# Altium project GargantuRAM_1_5_PRE_GITHUB.PrjPcb (part 3 of 3)

## Sheet Clock.SchDoc
size A0; SheetNumber: 10; SheetTotal: 12
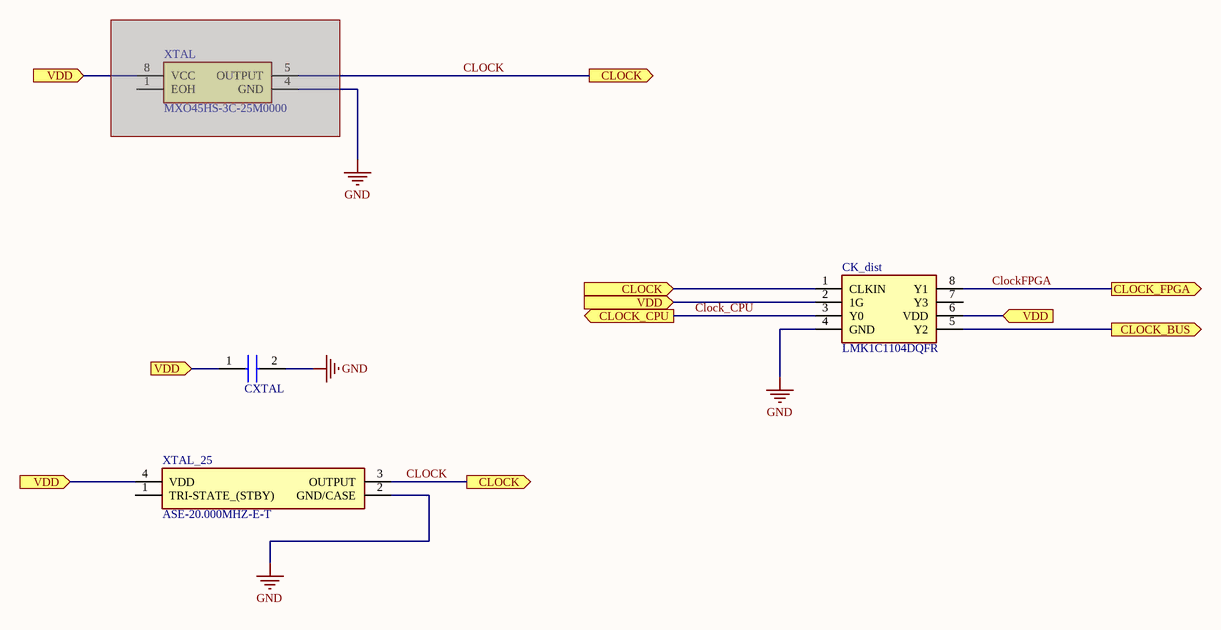
[diagram p18: Clock.SchDoc]

### Parts
CK_dist  LMK1C1104DQFR  [SON50P200X200X80-8N]
CXTAL  GRM155R71C104JA88D  [CAPC1005X55N]  (value not drawn)
XTAL  MXO45HS-3C-25M0000  [MXO45HS3C25M0000]  (masked out: inside a compile mask, not in the netlist)
XTAL_25  ASE-20.000MHZ-E-T  [ASE24576MHZLCT]

### Ports
CLOCK (in), CLOCK (out), CLOCK_BUS (out), CLOCK_CPU (out), CLOCK_FPGA (out), VDD (in)

### Nets
GND: CK_dist.4(GND) CXTAL.2 XTAL_25.2(GND/CASE)
CLOCK: CK_dist.1(CLKIN) XTAL_25.3(OUTPUT) ; port CLOCK
Clock_CPU: CK_dist.3(Y0) ; port CLOCK_CPU
ClockFPGA: CK_dist.8(Y1) ; port CLOCK_FPGA
VDD: CK_dist.2(1G) CK_dist.6(VDD) CXTAL.1 XTAL_25.4(VDD) ; port VDD
NetCK_dist_5: CK_dist.5(Y2) ; port CLOCK_BUS

Not connected (* = marked no-connect by the designer): CK_dist 7(Y3); XTAL_25 1(TRI-STATE_(STBY))

### Library data of the parts
CK_dist = LMK1C1104DQFR: Integrated Circuit; Manufacturer_Name: Texas Instruments; Datasheet Link: https://www.ti.com/lit/ds/symlink/lmk1c1104.pdf?ts=1625794058723&ref_url=https%253A%252F%252Fwww.ti.com%252Fproduct%252FLMK1C1104; Height: 0.8mm; Manufacturer_Part_Number: LMK1C1104DQFR; Mouser Part Number: 595-LMK1C1104DQFR; Mouser Price/Stock: https://www.mouser.co.uk/ProductDetail/Texas-Instruments/LMK1C1104DQFR?qs=QNEnbhJQKvYdwt0bSAj%252Blw%3D%3D; Arrow Part Number: LMK1C1104DQFR; Arrow Price/Stock: https://www.arrow.com/en/products/lmk1c1104dqfr/texas-instruments?utm_currency=USD&region=nac
CXTAL = GRM155R71C104JA88D: Capacitor; Manufacturer_Name: Murata Electronics; Datasheet Link: http://www.murata.com/~/media/webrenewal/support/library/catalog/products/capacitor/mlcc/c02e.pdf; Height: 0.55mm; Manufacturer_Part_Number: GRM155R71C104JA88D; Mouser Part Number: 81-GRM155R71C104JA8D; Mouser Price/Stock: https://www.mouser.co.uk/ProductDetail/Murata-Electronics/GRM155R71C104JA88D?qs=pwh76yelNxDjPOceoz6xEg%3D%3D; Arrow Part Number: GRM155R71C104JA88D; Arrow Price/Stock: https://www.arrow.com/en/products/grm155r71c104ja88d/murata-manufacturing?region=nac
XTAL = MXO45HS-3C-25M0000: Crystal or Oscillator; Manufacturer_Name: CTS; Datasheet Link: https://datasheet.datasheetarchive.com/originals/distributors/Datasheets-DGA23/1439510.pdf; Height: 5.1mm; Manufacturer_Part_Number: MXO45HS-3C-25M0000; Mouser Part Number: 774-MXO45HS-3C-25.0; Mouser Price/Stock: https://www.mouser.co.uk/ProductDetail/CTS-Electronic-Components/MXO45HS-3C-25M0000?qs=hbgUSdfWRJXvFrsG0%252BtHbQ%3D%3D; Arrow Part Number: MXO45HS-3C-25M0000; Arrow Price/Stock: https://www.arrow.com/en/products/mxo45hs-3c-25m0000/cts
XTAL_25 = ASE-20.000MHZ-E-T: Crystal or Oscillator; Manufacturer_Name: ABRACON; Datasheet Link: https://abracon.com/Oscillators/ASEseries.pdf; Height: 1.2mm; Manufacturer_Part_Number: ASE-20.000MHZ-E-T; Mouser Part Number: 815-ASE-20.0M-E-T; Mouser Price/Stock: https://www.mouser.co.uk/ProductDetail/ABRACON/ASE-20.000MHz-E-T?qs=s46Hw6dZPL6LHFubn7CneQ%3D%3D

## Sheet DataBUS.SchDoc
size A0; SheetNumber: 11; SheetTotal: 12
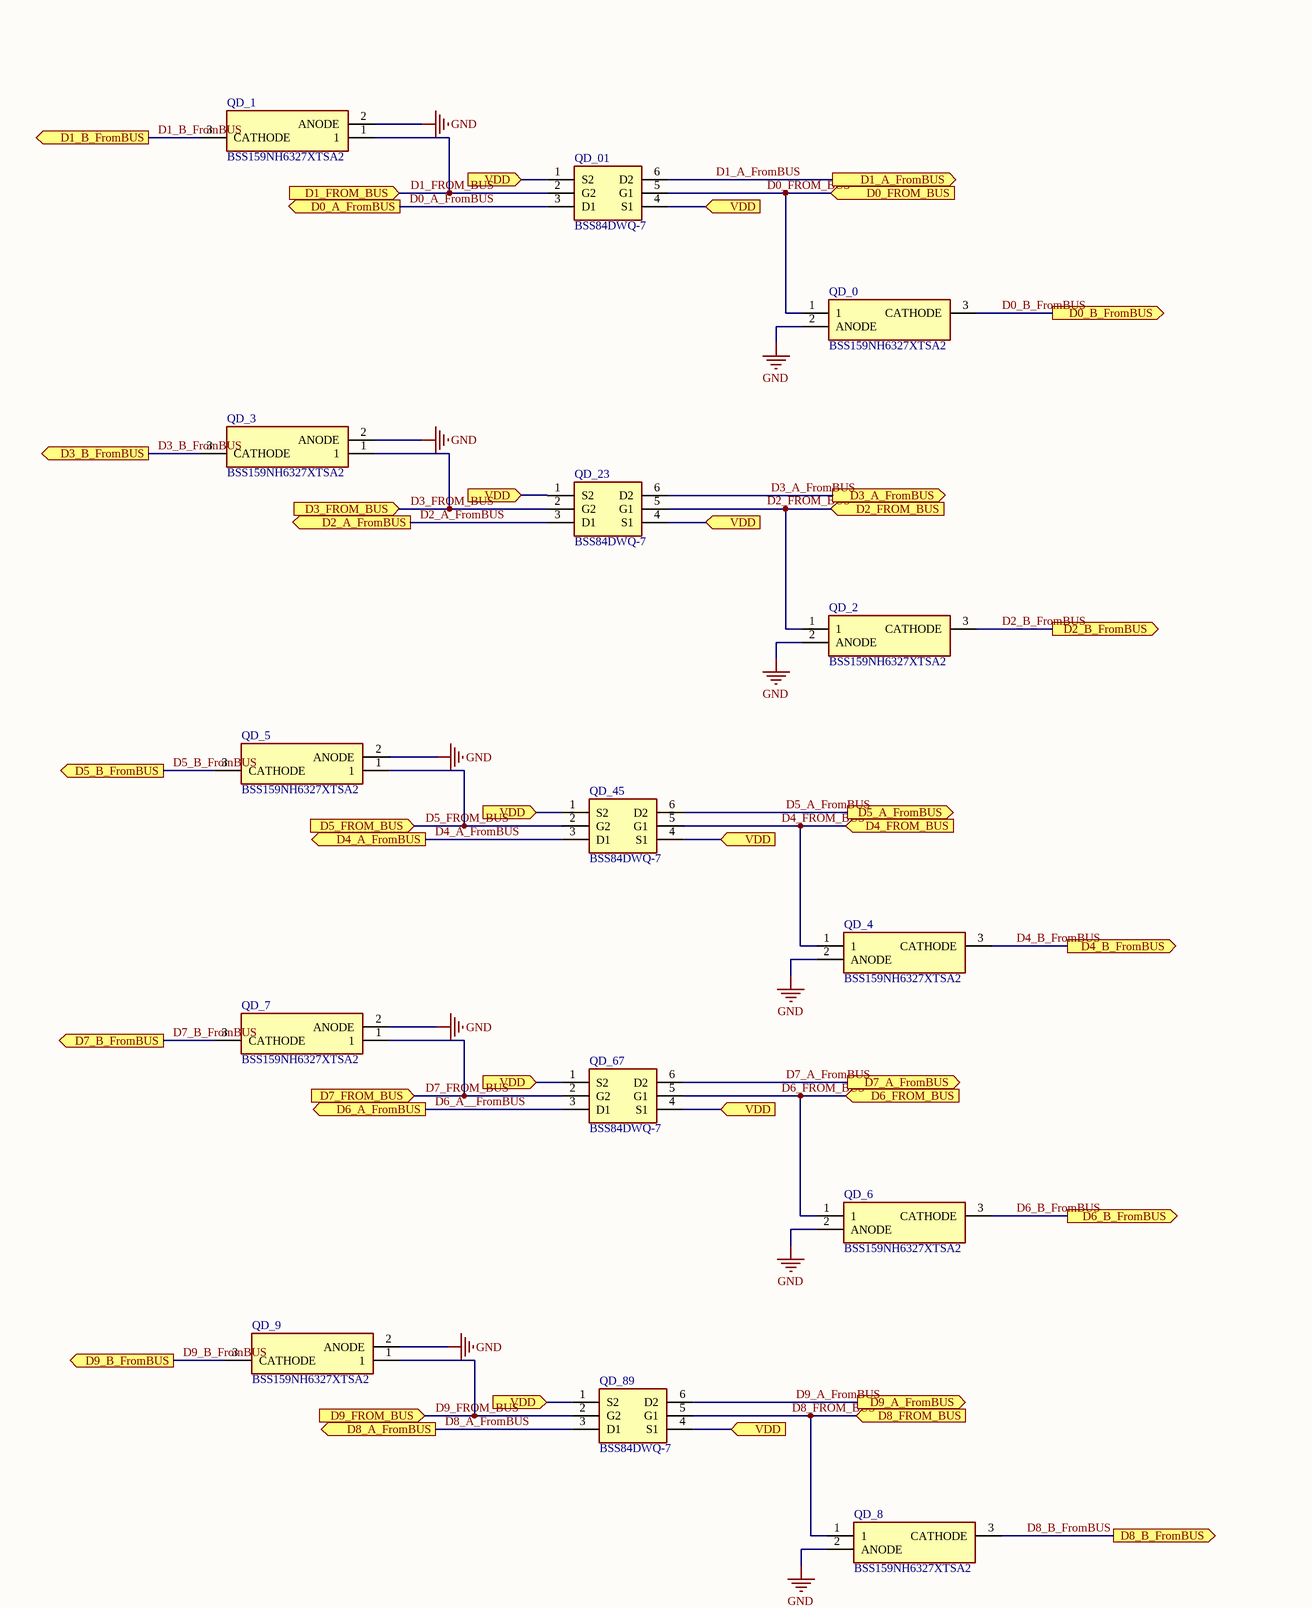
[diagram p19: DataBUS.SchDoc, top left]
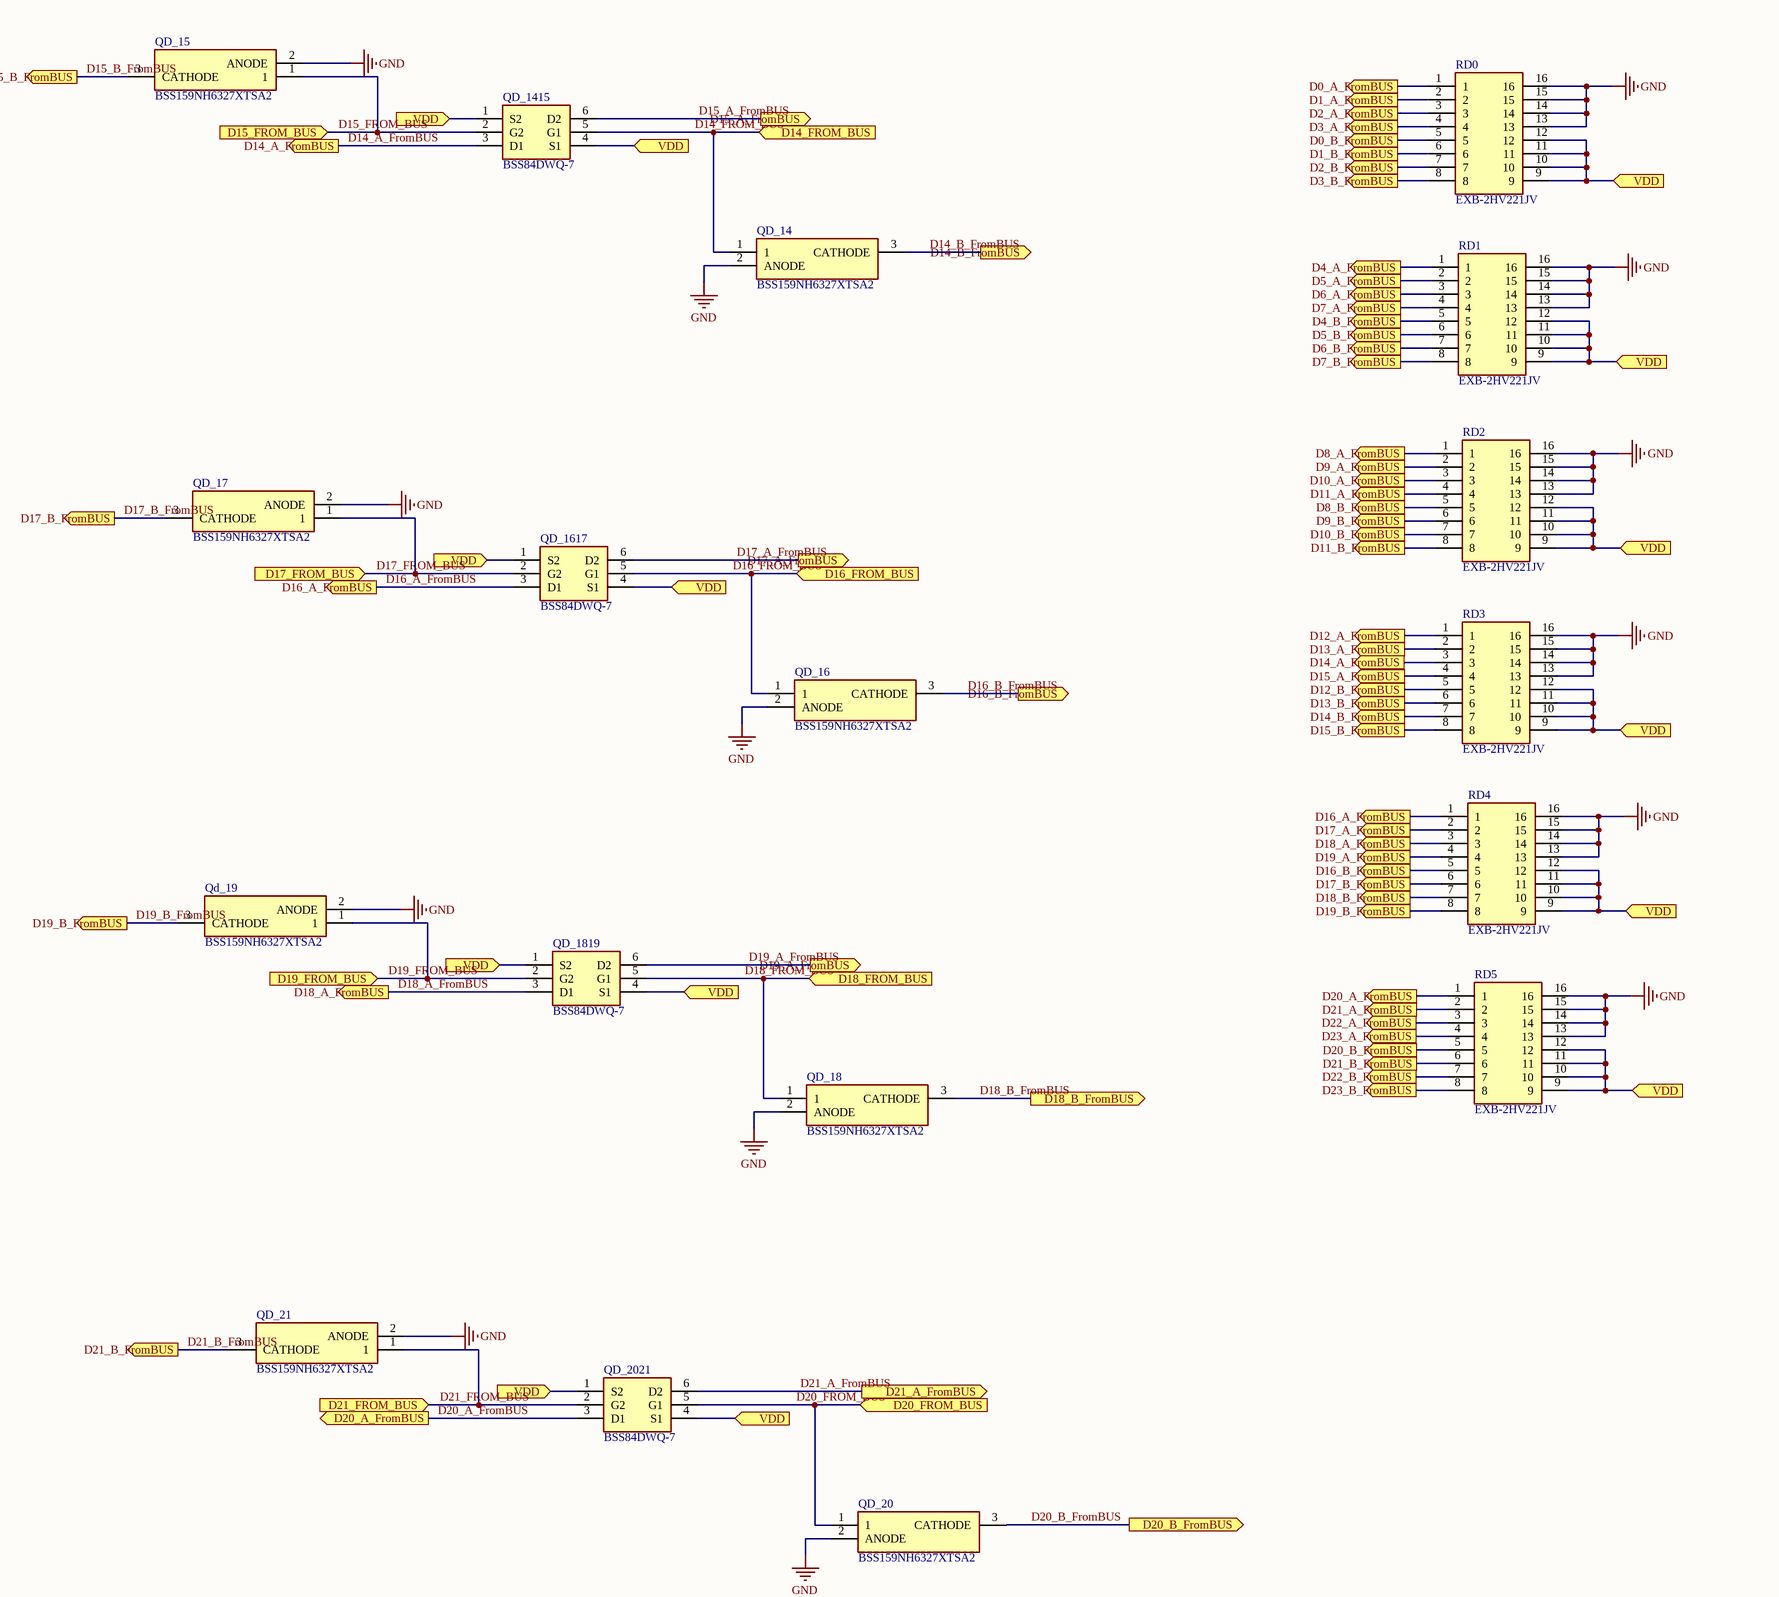
[diagram p20: DataBUS.SchDoc, top middle]
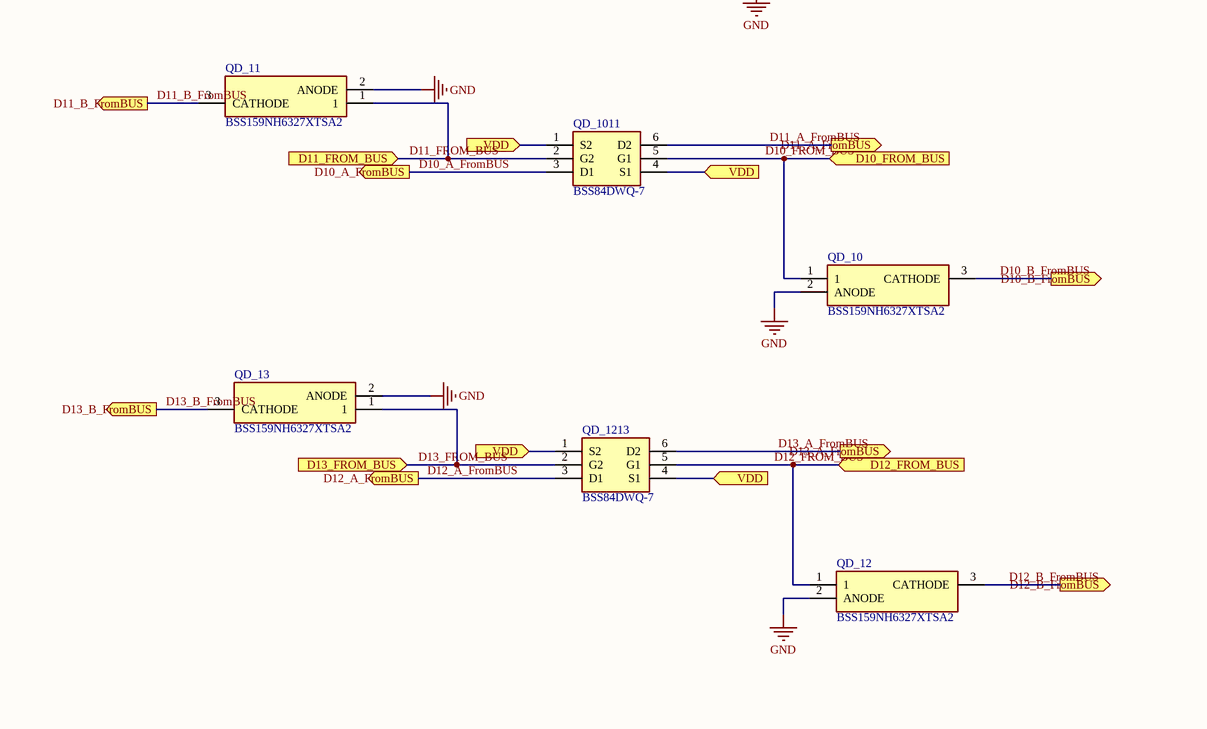
[diagram p21: DataBUS.SchDoc, bottom left]
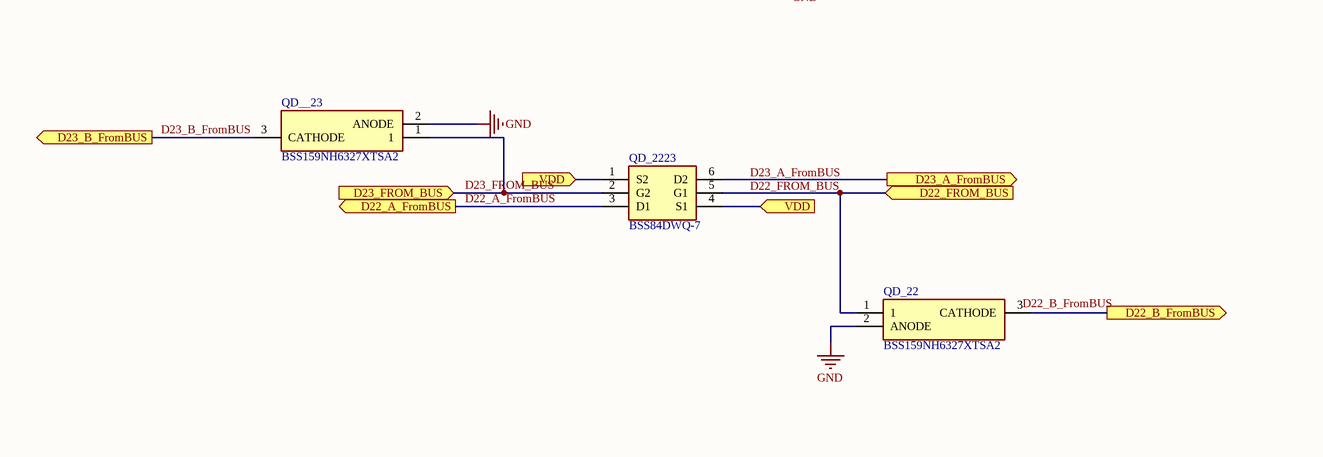
[diagram p22: DataBUS.SchDoc, bottom middle]
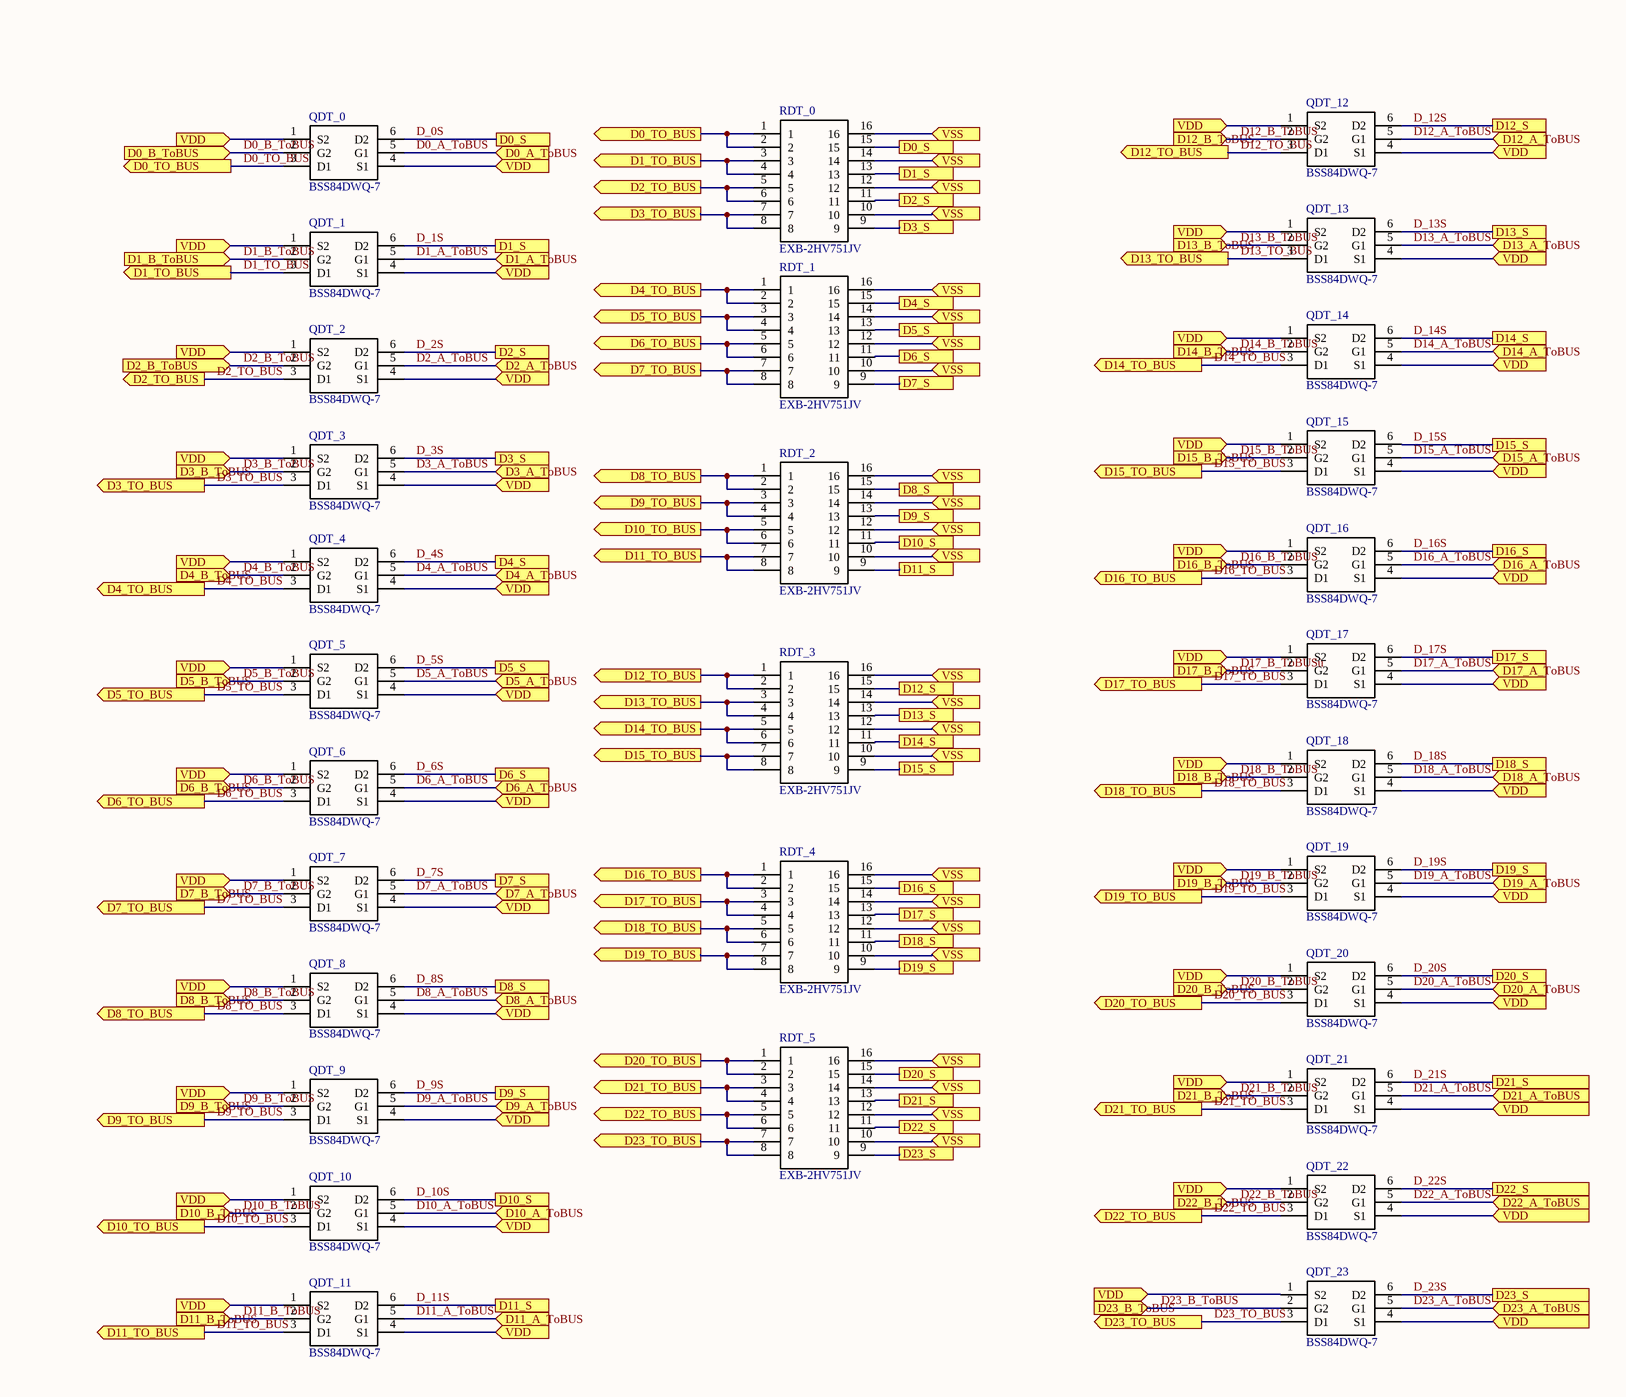
[diagram p23: DataBUS.SchDoc, bottom right]

### Parts
QD_0  BSS159NH6327XTSA2  [SOT95P260X110-3N]
QD_01  BSS84DWQ-7  [SOT65P210X110-6N]
QD_1  BSS159NH6327XTSA2  [SOT95P260X110-3N]
QD_2  BSS159NH6327XTSA2  [SOT95P260X110-3N]
QD_3  BSS159NH6327XTSA2  [SOT95P260X110-3N]
QD_4  BSS159NH6327XTSA2  [SOT95P260X110-3N]
QD_5  BSS159NH6327XTSA2  [SOT95P260X110-3N]
QD_6  BSS159NH6327XTSA2  [SOT95P260X110-3N]
QD_7  BSS159NH6327XTSA2  [SOT95P260X110-3N]
QD_8  BSS159NH6327XTSA2  [SOT95P260X110-3N]
QD_9  BSS159NH6327XTSA2  [SOT95P260X110-3N]
QD_10  BSS159NH6327XTSA2  [SOT95P260X110-3N]
QD_11  BSS159NH6327XTSA2  [SOT95P260X110-3N]
QD_12  BSS159NH6327XTSA2  [SOT95P260X110-3N]
QD_13  BSS159NH6327XTSA2  [SOT95P260X110-3N]
QD_14  BSS159NH6327XTSA2  [SOT95P260X110-3N]
QD_15  BSS159NH6327XTSA2  [SOT95P260X110-3N]
QD_16  BSS159NH6327XTSA2  [SOT95P260X110-3N]
QD_17  BSS159NH6327XTSA2  [SOT95P260X110-3N]
QD_18  BSS159NH6327XTSA2  [SOT95P260X110-3N]
Qd_19  BSS159NH6327XTSA2  [SOT95P260X110-3N]
QD_20  BSS159NH6327XTSA2  [SOT95P260X110-3N]
QD_21  BSS159NH6327XTSA2  [SOT95P260X110-3N]
QD_22  BSS159NH6327XTSA2  [SOT95P260X110-3N]
QD_23  BSS84DWQ-7  [SOT65P210X110-6N]
QD_45  BSS84DWQ-7  [SOT65P210X110-6N]
QD_67  BSS84DWQ-7  [SOT65P210X110-6N]
QD_89  BSS84DWQ-7  [SOT65P210X110-6N]
QD_1011  BSS84DWQ-7  [SOT65P210X110-6N]
QD_1213  BSS84DWQ-7  [SOT65P210X110-6N]
QD_1415  BSS84DWQ-7  [SOT65P210X110-6N]
QD_1617  BSS84DWQ-7  [SOT65P210X110-6N]
QD_1819  BSS84DWQ-7  [SOT65P210X110-6N]
QD_2021  BSS84DWQ-7  [SOT65P210X110-6N]
QD_2223  BSS84DWQ-7  [SOT65P210X110-6N]
QD__23  BSS159NH6327XTSA2  [SOT95P260X110-3N]
QDT_0  BSS84DWQ-7  [SOT65P210X110-6N]
QDT_1  BSS84DWQ-7  [SOT65P210X110-6N]
QDT_2  BSS84DWQ-7  [SOT65P210X110-6N]
QDT_3  BSS84DWQ-7  [SOT65P210X110-6N]
QDT_4  BSS84DWQ-7  [SOT65P210X110-6N]
QDT_5  BSS84DWQ-7  [SOT65P210X110-6N]
QDT_6  BSS84DWQ-7  [SOT65P210X110-6N]
QDT_7  BSS84DWQ-7  [SOT65P210X110-6N]
QDT_8  BSS84DWQ-7  [SOT65P210X110-6N]
QDT_9  BSS84DWQ-7  [SOT65P210X110-6N]
QDT_10  BSS84DWQ-7  [SOT65P210X110-6N]
QDT_11  BSS84DWQ-7  [SOT65P210X110-6N]
QDT_12  BSS84DWQ-7  [SOT65P210X110-6N]
QDT_13  BSS84DWQ-7  [SOT65P210X110-6N]
QDT_14  BSS84DWQ-7  [SOT65P210X110-6N]
QDT_15  BSS84DWQ-7  [SOT65P210X110-6N]
QDT_16  BSS84DWQ-7  [SOT65P210X110-6N]
QDT_17  BSS84DWQ-7  [SOT65P210X110-6N]
QDT_18  BSS84DWQ-7  [SOT65P210X110-6N]
QDT_19  BSS84DWQ-7  [SOT65P210X110-6N]
QDT_20  BSS84DWQ-7  [SOT65P210X110-6N]
QDT_21  BSS84DWQ-7  [SOT65P210X110-6N]
QDT_22  BSS84DWQ-7  [SOT65P210X110-6N]
QDT_23  BSS84DWQ-7  [SOT65P210X110-6N]
RD0  EXB-2HV221JV  [EXB2HV221JV]
RD1  EXB-2HV221JV  [EXB2HV221JV]
RD2  EXB-2HV221JV  [EXB2HV221JV]
RD3  EXB-2HV221JV  [EXB2HV221JV]
RD4  EXB-2HV221JV  [EXB2HV221JV]
RD5  EXB-2HV221JV  [EXB2HV221JV]
RDT_0  EXB-2HV751JV  [EXB2HV221JV]
RDT_1  EXB-2HV751JV  [EXB2HV221JV]
RDT_2  EXB-2HV751JV  [EXB2HV221JV]
RDT_3  EXB-2HV751JV  [EXB2HV221JV]
RDT_4  EXB-2HV751JV  [EXB2HV221JV]
RDT_5  EXB-2HV751JV  [EXB2HV221JV]

### Ports
D0_A_FromBUS (out), D0_A_ToBUS (in), D0_B_FromBUS (out), D0_B_ToBUS (in), D0_FROM_BUS (in), D0_S, D0_TO_BUS (out), D1_A_FromBUS (out), D1_A_ToBUS (in), D1_B_FromBUS (out), D1_B_ToBUS (in), D1_FROM_BUS (in), D1_S, D1_TO_BUS (out), D2_A_FromBUS (out), D2_A_ToBUS (in), D2_B_FromBUS (out), D2_B_ToBUS (in), D2_FROM_BUS (in), D2_S, D2_TO_BUS (out), D3_A_FromBUS (out), D3_A_ToBUS (in), D3_B_FromBUS (out), D3_B_ToBUS (in), D3_FROM_BUS (in), D3_S, D3_TO_BUS (out), D4_A_FromBUS (out), D4_A_ToBUS (in), D4_B_FromBUS (out), D4_B_ToBUS (in), D4_FROM_BUS (in), D4_S, D4_TO_BUS (out), D5_A_FromBUS (out), D5_A_ToBUS (in), D5_B_FromBUS (out), D5_B_ToBUS (in), D5_FROM_BUS (in), D5_S, D5_TO_BUS (out), D6_A_FromBUS (out), D6_A_ToBUS (in), D6_B_FromBUS (out), D6_B_ToBUS (in), D6_FROM_BUS (in), D6_S, D6_TO_BUS (out), D7_A_FromBUS (out), D7_A_ToBUS (in), D7_B_FromBUS (out), D7_B_ToBUS (in), D7_FROM_BUS (in), D7_S, D7_TO_BUS (out), D8_A_FromBUS (out), D8_A_ToBUS (in), D8_B_FromBUS (out), D8_B_ToBUS (in), D8_FROM_BUS (in), D8_S, D8_TO_BUS (out), D9_A_FromBUS (out), D9_A_ToBUS (in), D9_B_FromBUS (out), D9_B_ToBUS (in), D9_FROM_BUS (in), D9_S, D9_TO_BUS (out), D10_A_FromBUS (out), D10_A_ToBUS (in), D10_B_FromBUS (out), D10_B_ToBUS (in), D10_FROM_BUS (in), D10_S, D10_TO_BUS (out), D11_A_FromBUS (out), D11_A_ToBUS (in), D11_B_FromBUS (out), D11_B_ToBUS (in), D11_FROM_BUS (in), D11_S, D11_TO_BUS (out), D12_A_FromBUS (out), D12_A_ToBUS (in), D12_B_FromBUS (out), D12_B_ToBUS (in), D12_FROM_BUS (in), D12_S, D12_TO_BUS (out), D13_A_FromBUS (out), D13_A_ToBUS (in), D13_B_FromBUS (out), D13_B_ToBUS (in), D13_FROM_BUS (in), D13_S, D13_TO_BUS (out), D14_A_FromBUS (out), D14_A_ToBUS (in), D14_B_FromBUS (out), D14_B_ToBUS (in), D14_FROM_BUS (in), D14_S, D14_TO_BUS (out), D15_A_FromBUS (out), D15_A_ToBUS (in), D15_B_FromBUS (out), D15_B_ToBUS (in), D15_FROM_BUS (in), D15_S, D15_TO_BUS (out), D16_A_FromBUS (out), D16_A_ToBUS (in), D16_B_FromBUS (out), D16_B_ToBUS (in), D16_FROM_BUS (in), D16_S, D16_TO_BUS (out), D17_A_FromBUS (out), D17_A_ToBUS (in), D17_B_FromBUS (out), D17_B_ToBUS (in), D17_FROM_BUS (in), D17_S, D17_TO_BUS (out), D18_A_FromBUS (out), D18_A_ToBUS (in), D18_B_FromBUS (out), D18_B_ToBUS (in), D18_FROM_BUS (in), D18_S, D18_TO_BUS (out), D19_A_FromBUS (out), D19_A_ToBUS (in), D19_B_FromBUS (out), D19_B_ToBUS (in), D19_FROM_BUS (in), D19_S, D19_TO_BUS (out), D20_A_FromBUS (out), D20_A_ToBUS (in), D20_B_FromBUS (out), D20_B_ToBUS (in), D20_FROM_BUS (in), D20_S, D20_TO_BUS (out), D21_A_FromBUS (out), D21_A_ToBUS (in), D21_B_FromBUS (out), D21_B_ToBUS (in), D21_FROM_BUS (in), D21_S, D21_TO_BUS (out), D22_A_FromBUS (out), D22_A_ToBUS (in), D22_B_FromBUS (out), D22_B_ToBUS (in), D22_FROM_BUS (in), D22_S, D22_TO_BUS (out), D23_A_FromBUS (out), D23_A_ToBUS (in), D23_B_FromBUS (out), D23_B_ToBUS (in), D23_FROM_BUS (in), D23_S, D23_TO_BUS (out), VDD (in), VSS (in)

### Nets
GND: QD_0.2(ANODE) QD_1.2(ANODE) QD_2.2(ANODE) QD_3.2(ANODE) QD_4.2(ANODE) QD_5.2(ANODE) QD_6.2(ANODE) QD_7.2(ANODE) QD_8.2(ANODE) QD_9.2(ANODE) QD_10.2(ANODE) QD_11.2(ANODE) QD_12.2(ANODE) QD_13.2(ANODE) QD_14.2(ANODE) QD_15.2(ANODE) QD_16.2(ANODE) QD_17.2(ANODE) QD_18.2(ANODE) Qd_19.2(ANODE) QD_20.2(ANODE) QD_21.2(ANODE) QD_22.2(ANODE) QD__23.2(ANODE) RD0.13 RD0.14 RD0.15 RD0.16 RD1.13 RD1.14 RD1.15 RD1.16 RD2.13 RD2.14 RD2.15 RD2.16 RD3.13 RD3.14 RD3.15 RD3.16 RD4.13 RD4.14 RD4.15 RD4.16 RD5.13 RD5.14 RD5.15 RD5.16
D0_A_FromBUS: QD_01.3(D1) RD0.1 ; port D0_A_FromBUS
D0_A_ToBUS: QDT_0.5(G1) ; port D0_A_ToBUS
D0_B_FromBUS: QD_0.3(CATHODE) RD0.5 ; port D0_B_FromBUS
D0_B_ToBUS: QDT_0.2(G2) ; port D0_B_ToBUS
D0_FROM_BUS: QD_0.1 QD_01.5(G1) ; port D0_FROM_BUS
D0_TO_BUS: QDT_0.3(D1) RDT_0.1 RDT_0.2 ; port D0_TO_BUS
D1_A_FromBUS: QD_01.6(D2) RD0.2 ; port D1_A_FromBUS
D1_A_ToBUS: QDT_1.5(G1) ; port D1_A_ToBUS
D1_B_FromBUS: QD_1.3(CATHODE) RD0.6 ; port D1_B_FromBUS
D1_B_ToBUS: QDT_1.2(G2) ; port D1_B_ToBUS
D1_FROM_BUS: QD_1.1 QD_01.2(G2) ; port D1_FROM_BUS
D1_TO_BUS: QDT_1.3(D1) RDT_0.3 RDT_0.4 ; port D1_TO_BUS
D2_A_FromBUS: QD_23.3(D1) RD0.3 ; port D2_A_FromBUS
D2_A_ToBUS: QDT_2.5(G1) ; port D2_A_ToBUS
D2_B_FromBUS: QD_2.3(CATHODE) RD0.7 ; port D2_B_FromBUS
D2_B_ToBUS: QDT_2.2(G2) ; port D2_B_ToBUS
D2_FROM_BUS: QD_2.1 QD_23.5(G1) ; port D2_FROM_BUS
D2_TO_BUS: QDT_2.3(D1) RDT_0.5 RDT_0.6 ; port D2_TO_BUS
D3_A_FromBUS: QD_23.6(D2) RD0.4 ; port D3_A_FromBUS
D3_A_ToBUS: QDT_3.5(G1) ; port D3_A_ToBUS
D3_B_FromBUS: QD_3.3(CATHODE) RD0.8 ; port D3_B_FromBUS
D3_B_ToBUS: QDT_3.2(G2) ; port D3_B_ToBUS
D3_FROM_BUS: QD_3.1 QD_23.2(G2) ; port D3_FROM_BUS
D3_TO_BUS: QDT_3.3(D1) RDT_0.7 RDT_0.8 ; port D3_TO_BUS
D4_A_FromBUS: QD_45.3(D1) RD1.1 ; port D4_A_FromBUS
D4_A_ToBUS: QDT_4.5(G1) ; port D4_A_ToBUS
D4_B_FromBUS: QD_4.3(CATHODE) RD1.5 ; port D4_B_FromBUS
D4_B_ToBUS: QDT_4.2(G2) ; port D4_B_ToBUS
D4_FROM_BUS: QD_4.1 QD_45.5(G1) ; port D4_FROM_BUS
D4_TO_BUS: QDT_4.3(D1) RDT_1.1 RDT_1.2 ; port D4_TO_BUS
D5_A_FromBUS: QD_45.6(D2) RD1.2 ; port D5_A_FromBUS
D5_A_ToBUS: QDT_5.5(G1) ; port D5_A_ToBUS
D5_B_FromBUS: QD_5.3(CATHODE) RD1.6 ; port D5_B_FromBUS
D5_B_ToBUS: QDT_5.2(G2) ; port D5_B_ToBUS
D5_FROM_BUS: QD_5.1 QD_45.2(G2) ; port D5_FROM_BUS
D5_TO_BUS: QDT_5.3(D1) RDT_1.3 RDT_1.4 ; port D5_TO_BUS
D6_A__FromBUS: QD_67.3(D1) RD1.3 ; port D6_A_FromBUS
D6_A_ToBUS: QDT_6.5(G1) ; port D6_A_ToBUS
D6_B_FromBUS: QD_6.3(CATHODE) RD1.7 ; port D6_B_FromBUS
D6_B_ToBUS: QDT_6.2(G2) ; port D6_B_ToBUS
D6_FROM_BUS: QD_6.1 QD_67.5(G1) ; port D6_FROM_BUS
D6_TO_BUS: QDT_6.3(D1) RDT_1.5 RDT_1.6 ; port D6_TO_BUS
D7_A_FromBUS: QD_67.6(D2) RD1.4 ; port D7_A_FromBUS
D7_A_ToBUS: QDT_7.5(G1) ; port D7_A_ToBUS
D7_B_FromBUS: QD_7.3(CATHODE) RD1.8 ; port D7_B_FromBUS
D7_B_ToBUS: QDT_7.2(G2) ; port D7_B_ToBUS
D7_FROM_BUS: QD_7.1 QD_67.2(G2) ; port D7_FROM_BUS
D7_TO_BUS: QDT_7.3(D1) RDT_1.7 RDT_1.8 ; port D7_TO_BUS
D8_A_FromBUS: QD_89.3(D1) RD2.1 ; port D8_A_FromBUS
D8_A_ToBUS: QDT_8.5(G1) ; port D8_A_ToBUS
D8_B_FromBUS: QD_8.3(CATHODE) RD2.5 ; port D8_B_FromBUS
D8_B_ToBUS: QDT_8.2(G2) ; port D8_B_ToBUS
D8_FROM_BUS: QD_8.1 QD_89.5(G1) ; port D8_FROM_BUS
D8_TO_BUS: QDT_8.3(D1) RDT_2.1 RDT_2.2 ; port D8_TO_BUS
D9_A_FromBUS: QD_89.6(D2) RD2.2 ; port D9_A_FromBUS
D9_A_ToBUS: QDT_9.5(G1) ; port D9_A_ToBUS
D9_B_FromBUS: QD_9.3(CATHODE) RD2.6 ; port D9_B_FromBUS
D9_B_ToBUS: QDT_9.2(G2) ; port D9_B_ToBUS
D9_FROM_BUS: QD_9.1 QD_89.2(G2) ; port D9_FROM_BUS
D9_TO_BUS: QDT_9.3(D1) RDT_2.3 RDT_2.4 ; port D9_TO_BUS
D10_A_FromBUS: QD_1011.3(D1) RD2.3 ; port D10_A_FromBUS
D10_A_ToBUS: QDT_10.5(G1) ; port D10_A_ToBUS
D10_B_FromBUS: QD_10.3(CATHODE) RD2.7 ; port D10_B_FromBUS
D10_B_ToBUS: QDT_10.2(G2) ; port D10_B_ToBUS
D10_FROM_BUS: QD_10.1 QD_1011.5(G1) ; port D10_FROM_BUS
D10_TO_BUS: QDT_10.3(D1) RDT_2.5 RDT_2.6 ; port D10_TO_BUS
D11_A_FromBUS: QD_1011.6(D2) RD2.4 ; port D11_A_FromBUS
D11_A_ToBUS: QDT_11.5(G1) ; port D11_A_ToBUS
D11_B_FromBUS: QD_11.3(CATHODE) RD2.8 ; port D11_B_FromBUS
D11_B_ToBUS: QDT_11.2(G2) ; port D11_B_ToBUS
D11_FROM_BUS: QD_11.1 QD_1011.2(G2) ; port D11_FROM_BUS
D11_TO_BUS: QDT_11.3(D1) RDT_2.7 RDT_2.8 ; port D11_TO_BUS
D12_A_FromBUS: QD_1213.3(D1) RD3.1 ; port D12_A_FromBUS
D12_A_ToBUS: QDT_12.5(G1) ; port D12_A_ToBUS
D12_B_FromBUS: QD_12.3(CATHODE) RD3.5 ; port D12_B_FromBUS
D12_B_ToBUS: QDT_12.2(G2) ; port D12_B_ToBUS
D12_FROM_BUS: QD_12.1 QD_1213.5(G1) ; port D12_FROM_BUS
D12_TO_BUS: QDT_12.3(D1) RDT_3.1 RDT_3.2 ; port D12_TO_BUS
D13_A_FromBUS: QD_1213.6(D2) RD3.2 ; port D13_A_FromBUS
D13_A_ToBUS: QDT_13.5(G1) ; port D13_A_ToBUS
D13_B_FromBUS: QD_13.3(CATHODE) RD3.6 ; port D13_B_FromBUS
D13_B_ToBUS: QDT_13.2(G2) ; port D13_B_ToBUS
D13_FROM_BUS: QD_13.1 QD_1213.2(G2) ; port D13_FROM_BUS
D13_TO_BUS: QDT_13.3(D1) RDT_3.3 RDT_3.4 ; port D13_TO_BUS
D14_A_FromBUS: QD_1415.3(D1) RD3.3 ; port D14_A_FromBUS
D14_A_ToBUS: QDT_14.5(G1) ; port D14_A_ToBUS
D14_B_FromBUS: QD_14.3(CATHODE) RD3.7 ; port D14_B_FromBUS
D14_B_ToBUS: QDT_14.2(G2) ; port D14_B_ToBUS
D14_FROM_BUS: QD_14.1 QD_1415.5(G1) ; port D14_FROM_BUS
D14_TO_BUS: QDT_14.3(D1) RDT_3.5 RDT_3.6 ; port D14_TO_BUS
D15_A_FromBUS: QD_1415.6(D2) RD3.4 ; port D15_A_FromBUS
D15_A_ToBUS: QDT_15.5(G1) ; port D15_A_ToBUS
D15_B_FromBUS: QD_15.3(CATHODE) RD3.8 ; port D15_B_FromBUS
D15_B_ToBUS: QDT_15.2(G2) ; port D15_B_ToBUS
D15_FROM_BUS: QD_15.1 QD_1415.2(G2) ; port D15_FROM_BUS
D15_TO_BUS: QDT_15.3(D1) RDT_3.7 RDT_3.8 ; port D15_TO_BUS
D16_A_FromBUS: QD_1617.3(D1) RD4.1 ; port D16_A_FromBUS
D16_A_ToBUS: QDT_16.5(G1) ; port D16_A_ToBUS
D16_B_FromBUS: QD_16.3(CATHODE) RD4.5 ; port D16_B_FromBUS
D16_B_ToBUS: QDT_16.2(G2) ; port D16_B_ToBUS
D16_FROM_BUS: QD_16.1 QD_1617.5(G1) ; port D16_FROM_BUS
D16_TO_BUS: QDT_16.3(D1) RDT_4.1 RDT_4.2 ; port D16_TO_BUS
D17_A_FromBUS: QD_1617.6(D2) RD4.2 ; port D17_A_FromBUS
D17_A_ToBUS: QDT_17.5(G1) ; port D17_A_ToBUS
D17_B_FromBUS: QD_17.3(CATHODE) RD4.6 ; port D17_B_FromBUS
D17_B_ToBUSù: QDT_17.2(G2) ; port D17_B_ToBUS
D17_FROM_BUS: QD_17.1 QD_1617.2(G2) ; port D17_FROM_BUS
D17_TO_BUS: QDT_17.3(D1) RDT_4.3 RDT_4.4 ; port D17_TO_BUS
D18_A_FromBUS: QD_1819.3(D1) RD4.3 ; port D18_A_FromBUS
D18_A_ToBUS: QDT_18.5(G1) ; port D18_A_ToBUS
D18_B_FromBUS: QD_18.3(CATHODE) RD4.7 ; port D18_B_FromBUS
D18_B_ToBUS: QDT_18.2(G2) ; port D18_B_ToBUS
D18_FROM_BUS: QD_18.1 QD_1819.5(G1) ; port D18_FROM_BUS
D18_TO_BUS: QDT_18.3(D1) RDT_4.5 RDT_4.6 ; port D18_TO_BUS
D19_A_FromBUS: QD_1819.6(D2) RD4.4 ; port D19_A_FromBUS
D19_A_ToBUS: QDT_19.5(G1) ; port D19_A_ToBUS
D19_B_FromBUS: Qd_19.3(CATHODE) RD4.8 ; port D19_B_FromBUS
D19_B_ToBUS: QDT_19.2(G2) ; port D19_B_ToBUS
D19_FROM_BUS: Qd_19.1 QD_1819.2(G2) ; port D19_FROM_BUS
D19_TO_BUS: QDT_19.3(D1) RDT_4.7 RDT_4.8 ; port D19_TO_BUS
D20_A_FromBUS: QD_2021.3(D1) RD5.1 ; port D20_A_FromBUS
D20_A_ToBUS: QDT_20.5(G1) ; port D20_A_ToBUS
D20_B_FromBUS: QD_20.3(CATHODE) RD5.5 ; port D20_B_FromBUS
D20_B_ToBUS: QDT_20.2(G2) ; port D20_B_ToBUS
D20_FROM_BUS: QD_20.1 QD_2021.5(G1) ; port D20_FROM_BUS
D20_TO_BUS: QDT_20.3(D1) RDT_5.1 RDT_5.2 ; port D20_TO_BUS
D21_A_FromBUS: QD_2021.6(D2) RD5.2 ; port D21_A_FromBUS
D21_A_ToBUS: QDT_21.5(G1) ; port D21_A_ToBUS
D21_B_FromBUS: QD_21.3(CATHODE) RD5.6 ; port D21_B_FromBUS
D21_B_ToBUS: QDT_21.2(G2) ; port D21_B_ToBUS
D21_FROM_BUS: QD_21.1 QD_2021.2(G2) ; port D21_FROM_BUS
D21_TO_BUS: QDT_21.3(D1) RDT_5.3 RDT_5.4 ; port D21_TO_BUS
D22_A_FromBUS: QD_2223.3(D1) RD5.3 ; port D22_A_FromBUS
D22_A_ToBUS: QDT_22.5(G1) ; port D22_A_ToBUS
D22_B_ToBUS: QDT_22.2(G2) ; port D22_B_ToBUS
D22_TO_BUS: QDT_22.3(D1) RDT_5.5 RDT_5.6 ; port D22_TO_BUS
D23_A_ToBUS: QDT_23.5(G1) ; port D23_A_ToBUS
D23_B_FromBUS: QD__23.3(CATHODE) RD5.8 ; port D23_B_FromBUS
D23_B_ToBUS: QDT_23.2(G2) ; port D23_B_ToBUS
D23_FROM_BUS: QD_2223.2(G2) QD__23.1 ; port D23_FROM_BUS
D23_TO_BUS: QDT_23.3(D1) RDT_5.7 RDT_5.8 ; port D23_TO_BUS
D_0S: QDT_0.6(D2) RDT_0.15 ; port D0_S
D_1S: QDT_1.6(D2) RDT_0.13 ; port D1_S
D_2S: QDT_2.6(D2) RDT_0.11 ; port D2_S
D_3S: QDT_3.6(D2) RDT_0.9 ; port D3_S
D_4S: QDT_4.6(D2) RDT_1.15 ; port D4_S
D_5S: QDT_5.6(D2) RDT_1.13 ; port D5_S
D_6S: QDT_6.6(D2) RDT_1.11 ; port D6_S
D_7S: QDT_7.6(D2) RDT_1.9 ; port D7_S
D_8S: QDT_8.6(D2) RDT_2.15 ; port D8_S
D_9S: QDT_9.6(D2) RDT_2.13 ; port D9_S
D_10S: QDT_10.6(D2) RDT_2.11 ; port D10_S
D_11S: QDT_11.6(D2) RDT_2.9 ; port D11_S
D_12S: QDT_12.6(D2) RDT_3.15 ; port D12_S
D_13S: QDT_13.6(D2) RDT_3.13 ; port D13_S
D_14S: QDT_14.6(D2) RDT_3.11 ; port D14_S
D_15S: QDT_15.6(D2) RDT_3.9 ; port D15_S
D_16S: QDT_16.6(D2) RDT_4.15 ; port D16_S
D_17S: QDT_17.6(D2) RDT_4.13 ; port D17_S
D_18S: QDT_18.6(D2) RDT_4.11 ; port D18_S
D_19S: QDT_19.6(D2) RDT_4.9 ; port D19_S
D_20S: QDT_20.6(D2) RDT_5.15 ; port D20_S
D_21S: QDT_21.6(D2) RDT_5.13 ; port D21_S
D_22S: QDT_22.6(D2) RDT_5.11 ; port D22_S
D_23S: QDT_23.6(D2) RDT_5.9 ; port D23_S
VDD: QD_01.1(S2) QD_01.4(S1) QD_23.1(S2) QD_23.4(S1) QD_45.1(S2) QD_45.4(S1) QD_67.1(S2) QD_67.4(S1) QD_89.1(S2) QD_89.4(S1) QD_1011.1(S2) QD_1011.4(S1) QD_1213.1(S2) QD_1213.4(S1) QD_1415.1(S2) QD_1415.4(S1) QD_1617.1(S2) QD_1617.4(S1) QD_1819.1(S2) QD_1819.4(S1) QD_2021.1(S2) QD_2021.4(S1) QD_2223.1(S2) QD_2223.4(S1) QDT_0.1(S2) QDT_0.4(S1) QDT_1.1(S2) QDT_1.4(S1) QDT_2.1(S2) QDT_2.4(S1) QDT_3.1(S2) QDT_3.4(S1) QDT_4.1(S2) QDT_4.4(S1) QDT_5.1(S2) QDT_5.4(S1) QDT_6.1(S2) QDT_6.4(S1) QDT_7.1(S2) QDT_7.4(S1) QDT_8.1(S2) QDT_8.4(S1) QDT_9.1(S2) QDT_9.4(S1) QDT_10.1(S2) QDT_10.4(S1) QDT_11.1(S2) QDT_11.4(S1) QDT_12.1(S2) QDT_12.4(S1) QDT_13.1(S2) QDT_13.4(S1) QDT_14.1(S2) QDT_14.4(S1) QDT_15.1(S2) QDT_15.4(S1) QDT_16.1(S2) QDT_16.4(S1) QDT_17.1(S2) QDT_17.4(S1) QDT_18.1(S2) QDT_18.4(S1) QDT_19.1(S2) QDT_19.4(S1) QDT_20.1(S2) QDT_20.4(S1) QDT_21.1(S2) QDT_21.4(S1) QDT_22.1(S2) QDT_22.4(S1) QDT_23.1(S2) QDT_23.4(S1) RD0.9 RD0.10 RD0.11 RD0.12 RD1.9 RD1.10 RD1.11 RD1.12 RD2.9 RD2.10 RD2.11 RD2.12 RD3.9 RD3.10 RD3.11 RD3.12 RD4.9 RD4.10 RD4.11 RD4.12 RD5.9 RD5.10 RD5.11 RD5.12 ; port VDD
VSS: RDT_0.10 RDT_0.12 RDT_0.14 RDT_0.16 RDT_1.10 RDT_1.12 RDT_1.14 RDT_1.16 RDT_2.10 RDT_2.12 RDT_2.14 RDT_2.16 RDT_3.10 RDT_3.12 RDT_3.14 RDT_3.16 RDT_4.10 RDT_4.12 RDT_4.14 RDT_4.16 RDT_5.10 RDT_5.12 RDT_5.14 RDT_5.16 ; port VSS
NetLassye3_H8: QD_22.3(CATHODE) RD5.7 ; port D22_B_FromBUS
NetLassye3_H9: QD_2223.6(D2) RD5.4 ; port D23_A_FromBUS
NetQD_22_1: QD_22.1 QD_2223.5(G1) ; port D22_FROM_BUS

### Notes on the sheet
- Labels drawn without touching a wire or pin: D22_B_FromBUS, D22_FROM_BUS, D23_A_FromBUS

### Library data of the parts
QD_0-QD_18 Qd_19 QD_20-QD_22 QD__23 = BSS159NH6327XTSA2: Transistor; Manufacturer_Name: Infineon; Datasheet Link: http://www.infineon.com/dgdl/Infineon-BSS159N-DS-v02_02-en.pdf?fileId=db3a304330f68606013108d8b2230036; Height: 1.1mm; Manufacturer_Part_Number: BSS159NH6327XTSA2; Mouser Part Number: 726-BSS159NH6327XTSA; Mouser Price/Stock: https://www.mouser.co.uk/ProductDetail/Infineon-Technologies/BSS159NH6327XTSA2?qs=K00xGehIljvJjqRECkxDcQ%3D%3D; Arrow Part Number: BSS159NH6327XTSA2; Arrow Price/Stock: https://www.arrow.com/en/products/bss159nh6327xtsa2/infineon-technologies-ag?region=nac
QD_01 QD_23 QD_45 QD_67 QD_89 QD_1011 QD_1213 QD_1415 QD_1617 QD_1819 QD_2021 QD_2223 QDT_0-QDT_23 = BSS84DWQ-7: Transistor; Manufacturer_Name: Diodes Inc.; Datasheet Link: https://www.diodes.com/assets/Datasheets/BSS84DWQ.pdf; Height: 1.1mm; Manufacturer_Part_Number: BSS84DWQ-7; Mouser Part Number: 621-BSS84DWQ-7; Mouser Price/Stock: https://www.mouser.co.uk/ProductDetail/Diodes-Incorporated/BSS84DWQ-7?qs=W%2FMpXkg%252BdQ4tYNQw8VopWw%3D%3D; Arrow Part Number: BSS84DWQ-7; Arrow Price/Stock: https://www.arrow.com/en/products/bss84dwq-7/diodes-incorporated
RD0-RD5 RDT_0-RDT_5 = EXB-2HV221JV: Resistor Network; Manufacturer_Name: Panasonic; Datasheet Link: https://industrial.panasonic.com/cdbs/www-data/pdf/AOC0000/AOC0000C14.pdf; Height: 0.55mm; Manufacturer_Part_Number: EXB-2HV221JV; Mouser Part Number: 667-EXB-2HV221JV; Mouser Price/Stock: https://www.mouser.co.uk/ProductDetail/Panasonic/EXB-2HV221JV?qs=LZJzOuaToaVYOp9V2U%2F1Gw%3D%3D; Arrow Part Number: EXB-2HV221JV; Arrow Price/Stock: https://www.arrow.com/en/products/exb-2hv221jv/panasonic?region=europe

## Nets that join several sheets
GND: Serial_Ports (SER_1USB.1 SER_2.1), ROM (CRom.2 ROM.3 ROM.4), Power (26 pins), CPU_and_EXPANSION_BUS (40 pins), SD_RTC_SPI (5 pins), RAM (48 pins), FPGA (87 pins), AddressBUS (44 pins), Clock (CK_dist.4 CXTAL.2 XTAL_25.2), DataBUS (48 pins)
A0: CPU_and_EXPANSION_BUS (CPU.5), AddressBUS (QA_0.1 QA_01.5)
A0_A: FPGA (Lassye3.A15), AddressBUS (QA_01.3 RA0.1)
A0_B: FPGA (Lassye3.A16), AddressBUS (QA_0.3 RA0.5)
A1: CPU_and_EXPANSION_BUS (CPU.7), AddressBUS (QA_1.1 QA_01.2)
A1_A: FPGA (Lassye3.A17), AddressBUS (QA_01.6 RA0.2)
A1_B: FPGA (Lassye3.A20), AddressBUS (QA_1.3 RA0.6)
A2: CPU_and_EXPANSION_BUS (CPU.9), AddressBUS (QA_2.1 QA_23.5)
A2_A: FPGA (Lassye3.B14), AddressBUS (QA_23.3 RA0.3)
A2_B: FPGA (Lassye3.B15), AddressBUS (QA_2.3 RA0.7)
A3: CPU_and_EXPANSION_BUS (CPU.11), AddressBUS (QA_3.1 QA_23.2)
A3_A: FPGA (Lassye3.B16), AddressBUS (QA_23.6 RA0.4)
A3_B: FPGA (Lassye3.B17), AddressBUS (QA_3.3 RA0.8)
A4: CPU_and_EXPANSION_BUS (CPU.13), AddressBUS (QA_4.1 QA_45.5)
A4_A: FPGA (Lassye3.B19), AddressBUS (QA_45.3 RA1.1)
A4_B: FPGA (Lassye3.B20), AddressBUS (QA_4.3 RA1.5)
A5: CPU_and_EXPANSION_BUS (CPU.15), AddressBUS (QA_5.1 QA_45.2)
A5_A: FPGA (Lassye3.B22), AddressBUS (QA_45.6 RA1.2)
A5_B: FPGA (Lassye3.C15), AddressBUS (QA_5.3 RA1.6)
A6: CPU_and_EXPANSION_BUS (CPU.17), AddressBUS (QA_6.1 QA_67.5)
A6_A: FPGA (Lassye3.C16), AddressBUS (QA_67.3 RA1.3)
A6_B: FPGA (Lassye3.C18), AddressBUS (QA_6.3 RA1.7)
A7: CPU_and_EXPANSION_BUS (CPU.19), AddressBUS (QA_7.1 QA_67.2)
A7_A: FPGA (Lassye3.C19), AddressBUS (QA_67.6 RA1.4)
A7_B: FPGA (Lassye3.C21), AddressBUS (QA_7.3 RA1.8)
A8: CPU_and_EXPANSION_BUS (CPU.21), AddressBUS (QA_8.1 QA_89.5)
A8_A: FPGA (Lassye3.D15), AddressBUS (QA_89.3 RA2.1)
A8_B: FPGA (Lassye3.D19), AddressBUS (QA_8.3 RA2.5)
A9: CPU_and_EXPANSION_BUS (CPU.23), AddressBUS (QA_9.1 QA_89.2)
A9_A: FPGA (Lassye3.D20), AddressBUS (QA_89.6 RA2.2)
A9_B: FPGA (Lassye3.D21), AddressBUS (QA_9.3 RA2.6)
A10: CPU_and_EXPANSION_BUS (CPU.25), AddressBUS (QA_10.1 QA_1011.5)
A10_A: FPGA (Lassye3.C22), AddressBUS (QA_1011.3 RA2.3)
A10_B: FPGA (Lassye3.D22), AddressBUS (QA_10.3 RA2.7)
A11: CPU_and_EXPANSION_BUS (CPU.27), AddressBUS (QA_11.1 QA_1011.2)
A11_A: FPGA (Lassye3.E14), AddressBUS (QA_1011.6 RA2.4)
A11_B: FPGA (Lassye3.E15), AddressBUS (QA_11.3 RA2.8)
A12: CPU_and_EXPANSION_BUS (CPU.29), AddressBUS (QA_12.1 QA_1213.5)
A12_A: FPGA (Lassye3.E16), AddressBUS (QA_1213.3 RA3.1)
A12_B: FPGA (Lassye3.E19), AddressBUS (QA_12.3 RA3.5)
A13: CPU_and_EXPANSION_BUS (CPU.31), AddressBUS (QA_13.1 QA_1213.2)
A13_A: FPGA (Lassye3.E21), AddressBUS (QA_1213.6 RA3.2)
A13_B: FPGA (Lassye3.E22), AddressBUS (QA_13.3 RA3.6)
A14: CPU_and_EXPANSION_BUS (CPU.33), AddressBUS (QA_14.1 QA_1415.5)
A14_A: FPGA (Lassye3.F15), AddressBUS (QA_1415.3 RA3.3)
A14_B: FPGA (Lassye3.F16), AddressBUS (QA_14.3 RA3.7)
A15: CPU_and_EXPANSION_BUS (CPU.35), AddressBUS (QA_15.1 QA_1415.2)
A15_A: FPGA (Lassye3.F17), AddressBUS (QA_1415.6 RA3.4)
A15_B: FPGA (Lassye3.G15), AddressBUS (QA_15.3 RA3.8)
A16: CPU_and_EXPANSION_BUS (CPU.45), AddressBUS (QA_16.1 QA_1617.5)
A16_A: FPGA (Lassye3.G17), AddressBUS (QA_1617.3 RA4.1)
A16_B: FPGA (Lassye3.H16), AddressBUS (QA_16.3 RA4.5)
A17: CPU_and_EXPANSION_BUS (CPU.47), AddressBUS (QA_17.1 QA_1617.2)
A17_A: FPGA (Lassye3.J16), AddressBUS (QA_1617.6 RA4.2)
A17_B: FPGA (Lassye3.R15), AddressBUS (QA_17.3 RA4.6)
A18: CPU_and_EXPANSION_BUS (CPU.49), AddressBUS (QA_18.1 QA_1819.5)
A18_A: FPGA (Lassye3.T15), AddressBUS (QA_1819.3 RA4.3)
A18_B: FPGA (Lassye3.V15), AddressBUS (QA_18.3 RA4.7)
A19: CPU_and_EXPANSION_BUS (CPU.51), AddressBUS (QA_19.1 QA_1819.2)
A19_A: FPGA (Lassye3.W15), AddressBUS (QA_1819.6 RA4.4)
A19_B: FPGA (Lassye3.T12), AddressBUS (QA_19.3 RA4.8)
A20: CPU_and_EXPANSION_BUS (CPU.53), AddressBUS (QA_20.1 QA_2021.5)
A20_A: FPGA (Lassye3.AA15), AddressBUS (QA_2021.3 RA5.1)
A20_B: FPGA (Lassye3.AB15), AddressBUS (QA_20.3 RA5.5)
A21: CPU_and_EXPANSION_BUS (CPU.55), AddressBUS (QA_21.1 QA_2021.2)
A21_A: FPGA (Lassye3.AA16), AddressBUS (QA_2021.6 RA5.2)
A21_B: FPGA (Lassye3.AB16), AddressBUS (QA_21.3 RA5.6)
AUX_0: CPU_and_EXPANSION_BUS (CPU.68), FPGA (Lassye3.C11)
AUX_1: CPU_and_EXPANSION_BUS (CPU.66), FPGA (Lassye3.C13)
AUX_2: CPU_and_EXPANSION_BUS (CPU.61), FPGA (Lassye3.A14)
AUX_3: CPU_and_EXPANSION_BUS (CPU.62), FPGA (Lassye3.B13)
BA0: RAM (RAM_0.20 RAM_1.20 RAM_2.20), FPGA (Lassye3.AA11)
BA1: RAM (RAM_0.21 RAM_1.21 RAM_2.21), FPGA (Lassye3.AA12)
CASn: RAM (RAM_0.17 RAM_1.17 RAM_2.17), FPGA (Lassye3.AA8)
CKE: RAM (RAM_0.37 RAM_1.37 RAM_2.37), FPGA (Lassye3.AA5)
Clock_CPU: CPU_and_EXPANSION_BUS (CPU.64), Clock (CK_dist.3)
ClockFPGA: FPGA (Lassye3.M6 Lassye3.R4), Clock (CK_dist.8)
CSn: RAM (RAM_0.19 RAM_1.19 RAM_2.19), FPGA (Lassye3.AA10)
D0_A_FromBUS: FPGA (Lassye3.C3), DataBUS (QD_01.3 RD0.1)
D0_A_ToBUS: FPGA (Lassye3.A5), DataBUS (QDT_0.5)
D0_B_FromBUS: FPGA (Lassye3.C4), DataBUS (QD_0.3 RD0.5)
D0_B_ToBUS: FPGA (Lassye3.A6), DataBUS (QDT_0.2)
D0_FROM_BUS: CPU_and_EXPANSION_BUS (X0.13), DataBUS (QD_0.1 QD_01.5)
D0_TO_BUS: CPU_and_EXPANSION_BUS (X0.12), DataBUS (QDT_0.3 RDT_0.1 RDT_0.2)
D1_A_FromBUS: FPGA (Lassye3.C6), DataBUS (QD_01.6 RD0.2)
D1_A_ToBUS: FPGA (Lassye3.A7), DataBUS (QDT_1.5)
D1_B_FromBUS: FPGA (Lassye3.C7), DataBUS (QD_1.3 RD0.6)
D1_B_ToBUS: FPGA (Lassye3.A19), DataBUS (QDT_1.2)
D1_FROM_BUS: CPU_and_EXPANSION_BUS (X0.1), DataBUS (QD_1.1 QD_01.2)
D1_TO_BUS: CPU_and_EXPANSION_BUS (X0.2), DataBUS (QDT_1.3 RDT_0.3 RDT_0.4)
D2_A_FromBUS: FPGA (Lassye3.D2), DataBUS (QD_23.3 RD0.3)
D2_A_ToBUS: FPGA (Lassye3.B5), DataBUS (QDT_2.5)
D2_B_FromBUS: FPGA (Lassye3.D9), DataBUS (QD_2.3 RD0.7)
D2_B_ToBUS: FPGA (Lassye3.B6), DataBUS (QDT_2.2)
D2_FROM_BUS: CPU_and_EXPANSION_BUS (X0.3), DataBUS (QD_2.1 QD_23.5)
D2_TO_BUS: CPU_and_EXPANSION_BUS (X0.5), DataBUS (QDT_2.3 RDT_0.5 RDT_0.6)
D3_A_FromBUS: FPGA (Lassye3.D10), DataBUS (QD_23.6 RD0.4)
D3_A_ToBUS: FPGA (Lassye3.B7), DataBUS (QDT_3.5)
D3_B_FromBUS: FPGA (Lassye3.D11), DataBUS (QD_3.3 RD0.8)
D3_B_ToBUS: FPGA (Lassye3.D18), DataBUS (QDT_3.2)
D3_FROM_BUS: CPU_and_EXPANSION_BUS (X1.13), DataBUS (QD_3.1 QD_23.2)
D3_TO_BUS: CPU_and_EXPANSION_BUS (X1.12), DataBUS (QDT_3.3 RDT_0.7 RDT_0.8)
D4_A_FromBUS: FPGA (Lassye3.D14), DataBUS (QD_45.3 RD1.1)
D4_A_ToBUS: FPGA (Lassye3.E11), DataBUS (QDT_4.5)
D4_B_FromBUS: FPGA (Lassye3.E2), DataBUS (QD_4.3 RD1.5)
D4_B_ToBUS: FPGA (Lassye3.E12), DataBUS (QDT_4.2)
D4_FROM_BUS: CPU_and_EXPANSION_BUS (X1.1), DataBUS (QD_4.1 QD_45.5)
D4_TO_BUS: CPU_and_EXPANSION_BUS (X1.2), DataBUS (QDT_4.3 RDT_1.1 RDT_1.2)
D5_A_FromBUS: FPGA (Lassye3.E3), DataBUS (QD_45.6 RD1.2)
D5_A_ToBUS: FPGA (Lassye3.E13), DataBUS (QDT_5.5)
D5_B_FromBUS: FPGA (Lassye3.E4), DataBUS (QD_5.3 RD1.6)
D5_B_ToBUS: FPGA (Lassye3.H12), DataBUS (QDT_5.2)
D5_FROM_BUS: CPU_and_EXPANSION_BUS (X1.3), DataBUS (QD_5.1 QD_45.2)
D5_TO_BUS: CPU_and_EXPANSION_BUS (X1.5), DataBUS (QDT_5.3 RDT_1.3 RDT_1.4)
D6_A__FromBUS: FPGA (Lassye3.E5), DataBUS (QD_67.3 RD1.3)
D6_A_ToBUS: FPGA (Lassye3.H13), DataBUS (QDT_6.5)
D6_B_FromBUS: FPGA (Lassye3.E6), DataBUS (QD_6.3 RD1.7)
D6_B_ToBUS: FPGA (Lassye3.H14), DataBUS (QDT_6.2)
D6_FROM_BUS: CPU_and_EXPANSION_BUS (X2.13), DataBUS (QD_6.1 QD_67.5)
D6_TO_BUS: CPU_and_EXPANSION_BUS (X2.12), DataBUS (QDT_6.3 RDT_1.5 RDT_1.6)
D7_A_FromBUS: FPGA (Lassye3.E7), DataBUS (QD_67.6 RD1.4)
D7_A_ToBUS: FPGA (Lassye3.J2), DataBUS (QDT_7.5)
D7_B_FromBUS: FPGA (Lassye3.E8), DataBUS (QD_7.3 RD1.8)
D7_B_ToBUS: FPGA (Lassye3.J3), DataBUS (QDT_7.2)
D7_FROM_BUS: CPU_and_EXPANSION_BUS (X2.1), DataBUS (QD_7.1 QD_67.2)
D7_TO_BUS: CPU_and_EXPANSION_BUS (X2.2), DataBUS (QDT_7.3 RDT_1.7 RDT_1.8)
D8_A_FromBUS: FPGA (Lassye3.E9), DataBUS (QD_89.3 RD2.1)
D8_A_ToBUS: FPGA (Lassye3.J4), DataBUS (QDT_8.5)
D8_B_FromBUS: FPGA (Lassye3.E10), DataBUS (QD_8.3 RD2.5)
D8_B_ToBUS: FPGA (Lassye3.J5), DataBUS (QDT_8.2)
D8_FROM_BUS: CPU_and_EXPANSION_BUS (X2.3), DataBUS (QD_8.1 QD_89.5)
D8_TO_BUS: CPU_and_EXPANSION_BUS (X2.5), DataBUS (QDT_8.3 RDT_2.1 RDT_2.2)
D9_A_FromBUS: FPGA (Lassye3.F4), DataBUS (QD_89.6 RD2.2)
D9_A_ToBUS: FPGA (Lassye3.J7), DataBUS (QDT_9.5)
D9_B_FromBUS: FPGA (Lassye3.F5), DataBUS (QD_9.3 RD2.6)
D9_B_ToBUS: FPGA (Lassye3.J8), DataBUS (QDT_9.2)
D9_FROM_BUS: CPU_and_EXPANSION_BUS (X3.13), DataBUS (QD_9.1 QD_89.2)
D9_TO_BUS: CPU_and_EXPANSION_BUS (X3.12), DataBUS (QDT_9.3 RDT_2.3 RDT_2.4)
D10_A_FromBUS: FPGA (Lassye3.F6), DataBUS (QD_1011.3 RD2.3)
D10_A_ToBUS: FPGA (Lassye3.K2), DataBUS (QDT_10.5)
D10_B_FromBUS: FPGA (Lassye3.F7), DataBUS (QD_10.3 RD2.7)
D10_B_ToBUS: FPGA (Lassye3.K4), DataBUS (QDT_10.2)
D10_FROM_BUS: CPU_and_EXPANSION_BUS (X3.1), DataBUS (QD_10.1 QD_1011.5)
D10_TO_BUS: CPU_and_EXPANSION_BUS (X3.2), DataBUS (QDT_10.3 RDT_2.5 RDT_2.6)
D11_A_FromBUS: FPGA (Lassye3.F8), DataBUS (QD_1011.6 RD2.4)
D11_A_ToBUS: FPGA (Lassye3.K5), DataBUS (QDT_11.5)
D11_B_FromBUS: FPGA (Lassye3.F10), DataBUS (QD_11.3 RD2.8)
D11_B_ToBUS: FPGA (Lassye3.K6), DataBUS (QDT_11.2)
D11_FROM_BUS: CPU_and_EXPANSION_BUS (X3.3), DataBUS (QD_11.1 QD_1011.2)
D11_TO_BUS: CPU_and_EXPANSION_BUS (X3.5), DataBUS (QDT_11.3 RDT_2.7 RDT_2.8)
D12_A_FromBUS: FPGA (Lassye3.F12), DataBUS (QD_1213.3 RD3.1)
D12_A_ToBUS: FPGA (Lassye3.K7), DataBUS (QDT_12.5)
D12_B_FromBUS: FPGA (Lassye3.F13), DataBUS (QD_12.3 RD3.5)
D12_B_ToBUS: FPGA (Lassye3.K8), DataBUS (QDT_12.2)
D12_FROM_BUS: CPU_and_EXPANSION_BUS (X4.13), DataBUS (QD_12.1 QD_1213.5)
D12_TO_BUS: CPU_and_EXPANSION_BUS (X4.12), DataBUS (QDT_12.3 RDT_3.1 RDT_3.2)
D13_A_FromBUS: FPGA (Lassye3.G1), DataBUS (QD_1213.6 RD3.2)
D13_A_ToBUS: FPGA (Lassye3.K15), DataBUS (QDT_13.5)
D13_B_FromBUS: FPGA (Lassye3.G2), DataBUS (QD_13.3 RD3.6)
D13_B_ToBUS: FPGA (Lassye3.L1), DataBUS (QDT_13.2)
D13_FROM_BUS: CPU_and_EXPANSION_BUS (X4.1), DataBUS (QD_13.1 QD_1213.2)
D13_TO_BUS: CPU_and_EXPANSION_BUS (X4.2), DataBUS (QDT_13.3 RDT_3.3 RDT_3.4)
D14_A_FromBUS: FPGA (Lassye3.G3), DataBUS (QD_1415.3 RD3.3)
D14_A_ToBUS: FPGA (Lassye3.L2), DataBUS (QDT_14.5)
D14_B_FromBUS: FPGA (Lassye3.G4), DataBUS (QD_14.3 RD3.7)
D14_B_ToBUS: FPGA (Lassye3.L3), DataBUS (QDT_14.2)
D14_FROM_BUS: CPU_and_EXPANSION_BUS (X4.3), DataBUS (QD_14.1 QD_1415.5)
D14_TO_BUS: CPU_and_EXPANSION_BUS (X4.5), DataBUS (QDT_14.3 RDT_3.5 RDT_3.6)
D15_A_FromBUS: FPGA (Lassye3.G5), DataBUS (QD_1415.6 RD3.4)
D15_A_ToBUS: FPGA (Lassye3.L4), DataBUS (QDT_15.5)
D15_B_FromBUS: FPGA (Lassye3.G6), DataBUS (QD_15.3 RD3.8)
D15_B_ToBUS: FPGA (Lassye3.L5), DataBUS (QDT_15.2)
D15_FROM_BUS: CPU_and_EXPANSION_BUS (X5.13), DataBUS (QD_15.1 QD_1415.2)
D15_TO_BUS: CPU_and_EXPANSION_BUS (X5.12), DataBUS (QDT_15.3 RDT_3.7 RDT_3.8)
D16_A_FromBUS: FPGA (Lassye3.G7), DataBUS (QD_1617.3 RD4.1)
D16_A_ToBUS: FPGA (Lassye3.L6), DataBUS (QDT_16.5)
D16_B_FromBUS: FPGA (Lassye3.G8), DataBUS (QD_16.3 RD4.5)
D16_B_ToBUS: FPGA (Lassye3.L7), DataBUS (QDT_16.2)
D16_FROM_BUS: CPU_and_EXPANSION_BUS (X5.1), DataBUS (QD_16.1 QD_1617.5)
D16_TO_BUS: CPU_and_EXPANSION_BUS (X5.2), DataBUS (QDT_16.3 RDT_4.1 RDT_4.2)
D17_A_FromBUS: FPGA (Lassye3.G9), DataBUS (QD_1617.6 RD4.2)
D17_A_ToBUS: FPGA (Lassye3.L15), DataBUS (QDT_17.5)
D17_B_FromBUS: FPGA (Lassye3.G10), DataBUS (QD_17.3 RD4.6)
D17_B_ToBUSù: FPGA (Lassye3.M1), DataBUS (QDT_17.2)
D17_FROM_BUS: CPU_and_EXPANSION_BUS (X5.3), DataBUS (QD_17.1 QD_1617.2)
D17_TO_BUS: CPU_and_EXPANSION_BUS (X5.5), DataBUS (QDT_17.3 RDT_4.3 RDT_4.4)
D18_A_FromBUS: FPGA (Lassye3.G11), DataBUS (QD_1819.3 RD4.3)
D18_A_ToBUS: FPGA (Lassye3.M3), DataBUS (QDT_18.5)
D18_B_FromBUS: FPGA (Lassye3.G12), DataBUS (QD_18.3 RD4.7)
D18_B_ToBUS: FPGA (Lassye3.M4), DataBUS (QDT_18.2)
D18_FROM_BUS: CPU_and_EXPANSION_BUS (X6.13), DataBUS (QD_18.1 QD_1819.5)
D18_TO_BUS: CPU_and_EXPANSION_BUS (X6.12), DataBUS (QDT_18.3 RDT_4.5 RDT_4.6)
D19_A_FromBUS: FPGA (Lassye3.G13), DataBUS (QD_1819.6 RD4.4)
D19_A_ToBUS: FPGA (Lassye3.M7), DataBUS (QDT_19.5)
D19_B_FromBUS: FPGA (Lassye3.G14), DataBUS (Qd_19.3 RD4.8)
D19_B_ToBUS: FPGA (Lassye3.M15), DataBUS (QDT_19.2)
D19_FROM_BUS: CPU_and_EXPANSION_BUS (X6.1), DataBUS (Qd_19.1 QD_1819.2)
D19_TO_BUS: CPU_and_EXPANSION_BUS (X6.2), DataBUS (QDT_19.3 RDT_4.7 RDT_4.8)
D20_A_FromBUS: FPGA (Lassye3.H1), DataBUS (QD_2021.3 RD5.1)
D20_A_ToBUS: FPGA (Lassye3.N1), DataBUS (QDT_20.5)
D20_B_FromBUS: FPGA (Lassye3.H3), DataBUS (QD_20.3 RD5.5)
D20_B_ToBUS: FPGA (Lassye3.N2), DataBUS (QDT_20.2)
D20_FROM_BUS: CPU_and_EXPANSION_BUS (X6.3), DataBUS (QD_20.1 QD_2021.5)
D20_TO_BUS: CPU_and_EXPANSION_BUS (X6.5), DataBUS (QDT_20.3 RDT_5.1 RDT_5.2)
D21_A_FromBUS: FPGA (Lassye3.H4), DataBUS (QD_2021.6 RD5.2)
D21_A_ToBUS: FPGA (Lassye3.N4), DataBUS (QDT_21.5)
D21_B_FromBUS: FPGA (Lassye3.H6), DataBUS (QD_21.3 RD5.6)
D21_B_ToBUS: FPGA (Lassye3.N5), DataBUS (QDT_21.2)
D21_FROM_BUS: CPU_and_EXPANSION_BUS (X7.13), DataBUS (QD_21.1 QD_2021.2)
D21_TO_BUS: CPU_and_EXPANSION_BUS (X7.12), DataBUS (QDT_21.3 RDT_5.3 RDT_5.4)
D22_A_FromBUS: FPGA (Lassye3.H7), DataBUS (QD_2223.3 RD5.3)
D22_A_ToBUS: FPGA (Lassye3.N7), DataBUS (QDT_22.5)
D22_B_ToBUS: FPGA (Lassye3.P5), DataBUS (QDT_22.2)
D22_TO_BUS: CPU_and_EXPANSION_BUS (X7.2), DataBUS (QDT_22.3 RDT_5.5 RDT_5.6)
D23_A_ToBUS: FPGA (Lassye3.P6), DataBUS (QDT_23.5)
D23_B_FromBUS: FPGA (Lassye3.H11), DataBUS (QD__23.3 RD5.8)
D23_B_ToBUS: FPGA (Lassye3.P7), DataBUS (QDT_23.2)
D23_FROM_BUS: CPU_and_EXPANSION_BUS (X7.3), DataBUS (QD_2223.2 QD__23.1)
D23_TO_BUS: CPU_and_EXPANSION_BUS (X7.5), DataBUS (QDT_23.3 RDT_5.7 RDT_5.8)
DataID_0: CPU_and_EXPANSION_BUS (CPU.67), FPGA (Lassye3.B11)
DataID_1: CPU_and_EXPANSION_BUS (CPU.72), FPGA (Lassye3.B10)
INT: CPU_and_EXPANSION_BUS (CPU.71), FPGA (Lassye3.B9)
INT_A: CPU_and_EXPANSION_BUS (CPU.76), FPGA (Lassye3.B8)
LOCK: CPU_and_EXPANSION_BUS (CPU.70), FPGA (Lassye3.C12)
M_IO: CPU_and_EXPANSION_BUS (CPU.73), FPGA (Lassye3.A11)
MAIN_RESET: Power (C1uF_Reset.1 R10K_reset.1 Reset-Case.2), FPGA (Lassye3.R8)
MISO: ROM (ROM.2), SD_RTC_SPI (RTC.8 SD_1.P7), FPGA (Lassye3.A4)
MOSI: ROM (ROM.5), SD_RTC_SPI (RTC.9 SD_1.P2), FPGA (Lassye3.A2)
MSync: CPU_and_EXPANSION_BUS (CPU.69), FPGA (Lassye3.A9)
NetLassye3_AA13: RAM (RAM_0.23 RAM_1.23 RAM_2.23), FPGA (Lassye3.AA13)
NetLassye3_AB2: RAM (RAM_0.26 RAM_1.26 RAM_2.26), FPGA (Lassye3.AB2)
NetLassye3_AB3: RAM (RAM_0.29 RAM_1.29 RAM_2.29), FPGA (Lassye3.AB3)
NetLassye3_AB4: RAM (RAM_0.30 RAM_1.30 RAM_2.30), FPGA (Lassye3.AB4)
NetLassye3_AB5: RAM (RAM_0.31 RAM_1.31 RAM_2.31), FPGA (Lassye3.AB5)
NetLassye3_AB6: RAM (RAM_0.32 RAM_1.32 RAM_2.32), FPGA (Lassye3.AB6)
NetLassye3_AB7: RAM (RAM_0.33 RAM_1.33 RAM_2.33), FPGA (Lassye3.AB7)
NetLassye3_AB8: RAM (RAM_0.34 RAM_1.34 RAM_2.34), FPGA (Lassye3.AB8)
NetLassye3_AB9: RAM (RAM_0.22 RAM_1.22 RAM_2.22), FPGA (Lassye3.AB9)
NetLassye3_AB10: RAM (RAM_0.35 RAM_1.35 RAM_2.35), FPGA (Lassye3.AB10)
NetLassye3_AB11: RAM (RAM_0.2), FPGA (Lassye3.AB11)
NetLassye3_AB12: RAM (RAM_0.4), FPGA (Lassye3.AB12)
NetLassye3_AB13: RAM (RAM_0.5), FPGA (Lassye3.AB13)
NetLassye3_AB14: RAM (RAM_0.7), FPGA (Lassye3.AB14)
NetLassye3_AB17: RAM (RAM_0.11), FPGA (Lassye3.AB17)
NetLassye3_H8: FPGA (Lassye3.H8), DataBUS (QD_22.3 RD5.7)
NetLassye3_H9: FPGA (Lassye3.H9), DataBUS (QD_2223.6 RD5.4)
NetLassye3_P1: RAM (RAM_1.10), FPGA (Lassye3.P1)
NetLassye3_P2: RAM (RAM_1.11), FPGA (Lassye3.P2)
NetLassye3_P3: RAM (RAM_1.13), FPGA (Lassye3.P3)
NetLassye3_P4: RAM (RAM_1.53), FPGA (Lassye3.P4)
NetLassye3_R1: RAM (RAM_2.47), FPGA (Lassye3.R1)
NetLassye3_R2: RAM (RAM_2.48), FPGA (Lassye3.R2)
NetLassye3_R3: RAM (RAM_2.50), FPGA (Lassye3.R3)
NetLassye3_R6: RAM (RAM_2.51), FPGA (Lassye3.R6)
NetLassye3_R7: RAM (RAM_2.53), FPGA (Lassye3.R7)
NetLassye3_R10: RAM (RAM_0.36 RAM_1.36 RAM_2.36), FPGA (Lassye3.R10)
NetLassye3_T6: RAM (RAM_2.42), FPGA (Lassye3.T6)
NetLassye3_T8: RAM (RAM_2.44), FPGA (Lassye3.T8)
NetLassye3_T10: RAM (RAM_2.45), FPGA (Lassye3.T10)
NetLassye3_T13: RAM (RAM_0.8), FPGA (Lassye3.T13)
NetLassye3_T14: RAM (RAM_0.10), FPGA (Lassye3.T14)
NetLassye3_U7: RAM (RAM_2.2), FPGA (Lassye3.U7)
NetLassye3_U8: RAM (RAM_2.4), FPGA (Lassye3.U8)
NetLassye3_U9: RAM (RAM_2.5), FPGA (Lassye3.U9)
NetLassye3_U10: RAM (RAM_2.7), FPGA (Lassye3.U10)
NetLassye3_U11: RAM (RAM_2.8), FPGA (Lassye3.U11)
NetLassye3_U12: RAM (RAM_2.10), FPGA (Lassye3.U12)
NetLassye3_U13: RAM (RAM_2.11), FPGA (Lassye3.U13)
NetLassye3_U14: RAM (RAM_2.13), FPGA (Lassye3.U14)
NetLassye3_V7: RAM (RAM_1.42), FPGA (Lassye3.V7)
NetLassye3_V8: RAM (RAM_1.44), FPGA (Lassye3.V8)
NetLassye3_V9: RAM (RAM_1.45), FPGA (Lassye3.V9)
NetLassye3_V10: RAM (RAM_1.47), FPGA (Lassye3.V10)
NetLassye3_V11: RAM (RAM_1.48), FPGA (Lassye3.V11)
NetLassye3_V12: RAM (RAM_1.50), FPGA (Lassye3.V12)
NetLassye3_V14: RAM (RAM_1.51), FPGA (Lassye3.V14)
NetLassye3_W2: RAM (RAM_0.48), FPGA (Lassye3.W2)
NetLassye3_W3: RAM (RAM_0.50), FPGA (Lassye3.W3)
NetLassye3_W4: RAM (RAM_0.51), FPGA (Lassye3.W4)
NetLassye3_W8: RAM (RAM_0.53), FPGA (Lassye3.W8)
NetLassye3_W9: RAM (RAM_1.2), FPGA (Lassye3.W9)
NetLassye3_W10: RAM (RAM_1.4), FPGA (Lassye3.W10)
NetLassye3_W11: RAM (RAM_1.5), FPGA (Lassye3.W11)
NetLassye3_W12: RAM (RAM_1.7), FPGA (Lassye3.W12)
NetLassye3_W14: RAM (RAM_1.8), FPGA (Lassye3.W14)
NetLassye3_Y1: RAM (RAM_0.13), FPGA (Lassye3.Y1)
NetLassye3_Y6: RAM (RAM_0.42), FPGA (Lassye3.Y6)
NetLassye3_Y7: RAM (RAM_0.44), FPGA (Lassye3.Y7)
NetLassye3_Y13: RAM (RAM_0.45), FPGA (Lassye3.Y13)
NetLassye3_Y14: RAM (RAM_0.47), FPGA (Lassye3.Y14)
NetQD_22_1: CPU_and_EXPANSION_BUS (X7.1), DataBUS (QD_22.1 QD_2223.5)
R_W: CPU_and_EXPANSION_BUS (CPU.75), FPGA (Lassye3.A8)
R_W_Internal: CPU_and_EXPANSION_BUS (24 pins), FPGA (Lassye3.D1)
RAM_CLK: RAM (RAM_0.38 RAM_1.38 RAM_2.38), FPGA (Lassye3.AA6)
RASn: RAM (RAM_0.18 RAM_1.18 RAM_2.18), FPGA (Lassye3.AA7)
Reset: CPU_and_EXPANSION_BUS (CPU.63), FPGA (Lassye3.A12)
RESET_N: Power (C_Reset.2 R_Reset.1), FPGA (Lassye3.V4)
ROM_CSn: ROM (ROM.1), SD_RTC_SPI (RCSn.4), FPGA (Lassye3.A21)
RTC_CLOCK: SD_RTC_SPI (RTC.13), FPGA (Lassye3.R12)
RTC_CSn: SD_RTC_SPI (RCSn.1 RTC.6), FPGA (Lassye3.B21)
RTC_IRQ: SD_RTC_SPI (RTC.5), FPGA (Lassye3.A18)
RX_S1: Serial_Ports (SER_1USB.2), FPGA (Lassye3.B1)
RX_S2: Serial_Ports (SER_2.2), FPGA (Lassye3.C1)
SCLK: ROM (ROM.6), SD_RTC_SPI (RTC.10 SD_1.P5), FPGA (Lassye3.A3)
SD_CSn: SD_RTC_SPI (RCSn.3 SD_1.P1), FPGA (Lassye3.E1)
SDRAM_A1: RAM (RAM_0.24 RAM_1.24 RAM_2.24), FPGA (Lassye3.AA1)
SDRAM_A2: RAM (RAM_0.25 RAM_1.25 RAM_2.25), FPGA (Lassye3.AA2)
SSync: CPU_and_EXPANSION_BUS (CPU.74), FPGA (Lassye3.A10)
TX_S1: Serial_Ports (SER_1USB.3), FPGA (Lassye3.B2)
TX_S2: Serial_Ports (SER_2.3), FPGA (Lassye3.C2)
VCC_1V2: Power (L_INT.2), FPGA (31 pins)
VCCA_PLL: Power (C_PLL.1 C_PLL_A.1 FB_VCCA.2), FPGA (6 pins)
VDD: ROM (CRom.1 ROM.7 ROM.8), Power (8 pins), CPU_and_EXPANSION_BUS (20 pins), SD_RTC_SPI (8 pins), RAM (42 pins), FPGA (60 pins), AddressBUS (44 pins), Clock (CK_dist.2 CK_dist.6 CXTAL.1 XTAL_25.4), DataBUS (96 pins)
VSS: Power (6 pins), CPU_and_EXPANSION_BUS (20 pins), DataBUS (24 pins)
Wait: CPU_and_EXPANSION_BUS (CPU.65), FPGA (Lassye3.A13)
WEn: RAM (RAM_0.16 RAM_1.16 RAM_2.16), FPGA (Lassye3.AA9)